# EAGLE design Fali_Potis (EAGLE 6.1)

## Sheet 1 of 2
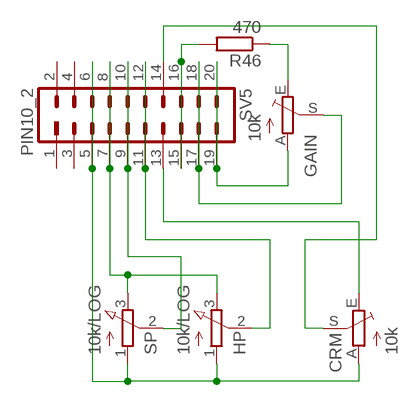
[diagram p0: schematic, sheet 1]

### Parts
CRM  10k  TRIM_EU-PT10S  [PT-10S]
GAIN  10k  TRIM_EU-PT10S  [PT-10S]
HP  10k/LOG  3RP/1610N  [3RP/1610N]
R46  470  R-EU_R0805  [R0805]
SP  10k/LOG  3RP/1610N  [3RP/1610N]
SV5  PIN10_2  [PIN10_2]

### Nets
N$10: CRM.E SV5.13
N$11: CRM.A HP.1(A) SP.1(A) SV5.5 SV5.6
N$30: HP.3(E) SP.3(E) SV5.7 SV5.8
N$33: SP.2(S) SV5.9 SV5.10
N$48: HP.2(S) SV5.11 SV5.12
N$58: CRM.S SV5.14
N$68: R46.2 SV5.15 SV5.16
N$69: GAIN.S SV5.17 SV5.18
N$70: GAIN.A SV5.19 SV5.20
N$73: GAIN.E R46.1
Unconnected: SV5.1 SV5.2 SV5.3 SV5.4

## Sheet 2 of 2

## Library data of the parts
CRM GAIN = pot:TRIM_EU-: POTENTIOMETER
HP SP = pot:3RP/1610N: 16mm Potentiometer one level Source: http://www.alphapotentiometers.net/html/16mm_pot_2.html
R46 = rcl:R-EU_: RESISTOR, European symbol
SV5 = Cf_Csatl:PIN10_2

## Net classes
0 default: width 0.305 mm, clearance 0.305 mm

## Board
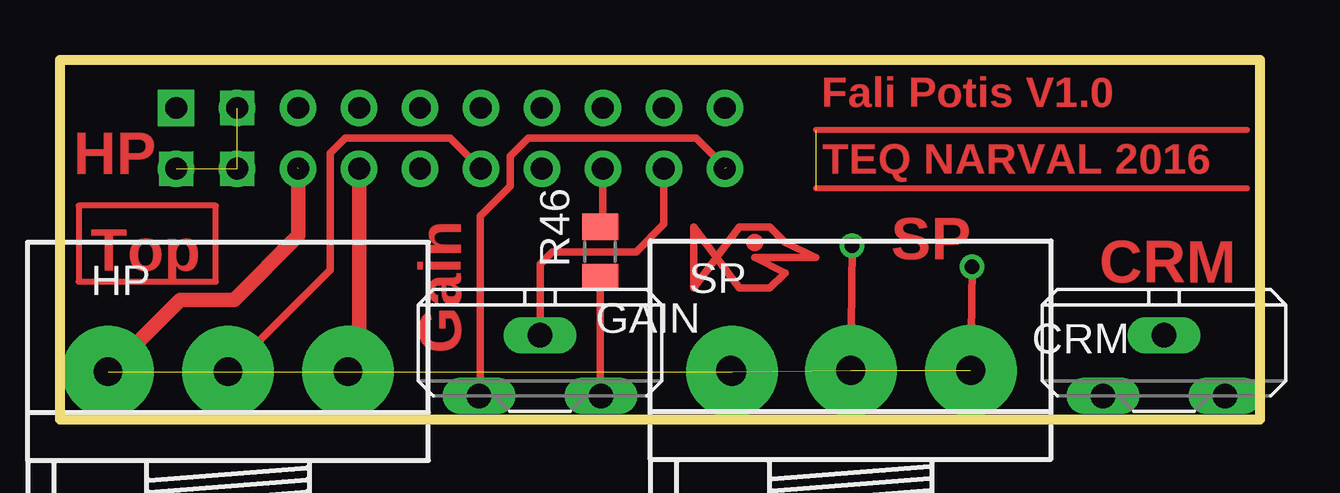
[diagram p1: board, top side]
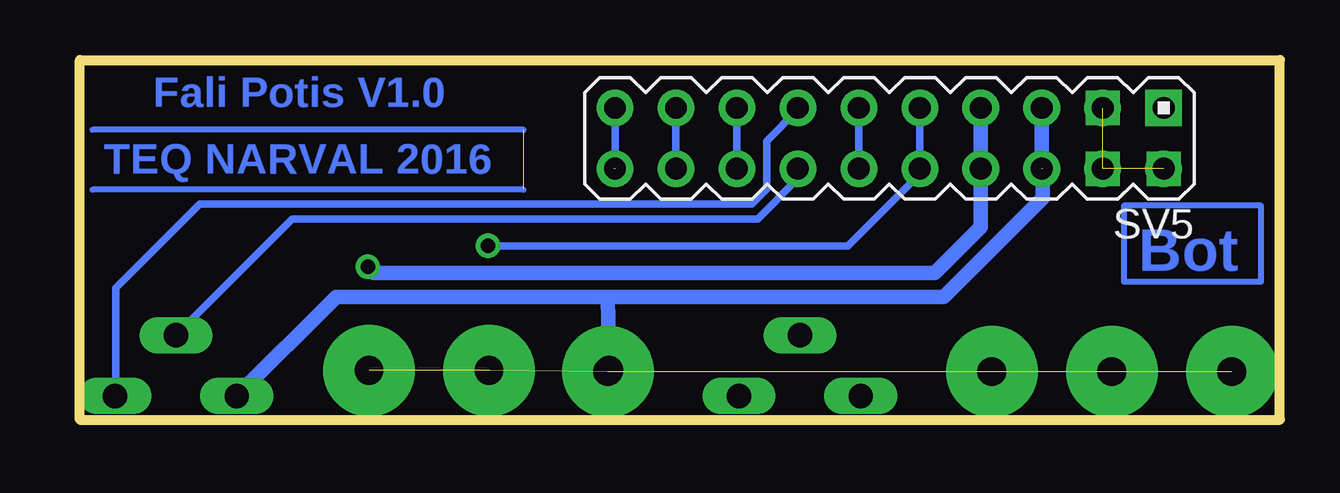
[diagram p2: board, bottom side, seen from below]

Size 50 x 15 mm. Coordinates in mm from the lower left corner, seen from the top.
Outline: 50,0 0,0 0,15 50,15 50,0
Copper layers (1*16): Top 0.035mm / dielectric 1.5mm / Bottom 0.035mm
Design rules: minimum track width 10mil, minimum drill 24mil, track to track 12mil, track to pad 12mil, pad to pad 12mil, via to via 12mil, smd to smd 10mil, copper to edge 10mil, drill to drill 10mil, minimum pad ring 10mil, minimum via ring 8mil, stop-mask expansion 4mil, vias tented up to drill 0mil, thermal gap 10mil

### Footprints (pad centres in the part's own frame; a part is rotated, then mirrored left to right if it is on the bottom)
PT-10S = drill 1.016 long: A -2.54,-1.27; E 2.54,-1.27; S 0,1.27
3RP/1610N = drill 1.2 pad 2.184: 1 -5,0; 2 0,0; 3 5,0
R0805 = smd 1.1 x 1.5: 1 -1.05,0; 2 1.05,0
PIN10_2 = drill 0.914 pad 1.524 square: 1 -10.16,0 | drill 0.914 pad 1.524: 2 -10.16,2.54; 3 -7.62,0; 4 -7.62,2.54; 5 -5.08,0; 6 -5.08,2.54; 7 -2.54,0; 8 -2.54,2.54; 9 0,0; 10 0,2.54; 11 2.54,0; 12 2.54,2.54; 13 5.08,0; 14 5.08,2.54; 15 7.62,0; 16 7.62,2.54; 17 10.16,0; 18 10.16,2.54; 19 12.7,0; 20 12.7,2.54

### Placement (x,y rotation side)
CRM  46,2.25 0 top
GAIN  20,2.25 0 top
HP  7,2 0 top
R46  22.5,7 90 top
SP  32.95,2.05 0 top
SV5  15,13 180 bottom

### Tracks (layer width: path | path; a pad name or v marks a point on that pad's centre or on a via)
HALACSKA1
  Top 0.305: 26.41,8.02 26.41,5.48 28.31,8.02 29.58,8.02 30.21,7.39 31.48,6.75 28.95,6.75 30.21,6.12 29.58,5.48 28.31,5.48 26.41,8.02
N$1  (2 unrouted)
  Top 0.254: 31.51,12.09 49.47,12.09
  Bottom 0.254: 31.51,9.59 49.47,9.59 | 31.51,12.09 49.47,12.09
N$2
  Top 0.254: 49.47,9.64 31.51,9.64
N$3  (via drill 1.2 pad 3.81)  (5 unrouted)
  other vias: 2,2 7,2 12,2 28,2 32.95,2.05 37.95,2.05
N$5  (via drill 0.91 pad 1.42)  (2 unrouted)
  other vias: 7.38,13 7.38,10.46 4.84,10.46
N$10
  Bottom 0.305: CRM.E 48.5,1.02 48.5,5.5 45,9 22,9 21.38,9.62 21.38,11.62 20.08,12.92 SV5.13
N$11  (1 unrouted)
  Top 0.61: HP.1 5,5 7.25,5 9.92,7.67 SV5.6
  Bottom 0.61: CRM.A 39.31,5.12 28,5.12 | 28,5.12 14,5.12 9.88,9.25 9.88,10.5 | SP.1 28,5.12 | SV5.5 SV5.6
N$30  (via drill 0.6)
  Top 0.305: SP.3 v38,6.38
  Top 0.61: HP.3 12.46,2.46 SV5.8
  Bottom 0.61: v38,6.38 37.75,6.12 14.38,6.12 12.46,8.04 SV5.8 SV5.7
N$33  (via drill 0.61)
  Top 0.305: SP.2 v33,7.25
  Bottom 0.305: v33,7.25 18,7.25 15,10.25 SV5.10 SV5.9
N$48
  Top 0.305: HP.2 11.25,6.25 11.25,11.12 11.88,11.75 16.25,11.75 SV5.12
  Bottom 0.305: SV5.11 SV5.12
N$58
  Bottom 0.305: CRM.S 41.15,8.38 21.75,8.38 20.08,10.04 SV5.14
N$68
  Top 0.305: R46.2 22.62,8.17 SV5.16
  Bottom 0.305: SV5.15 SV5.16
N$69
  Top 0.305: GAIN.S 20,6.5 20.5,7 24,7 25.16,8.16 SV5.18
  Bottom 0.305: SV5.17 SV5.18
N$70  (1 unrouted)
  Top 0.305: GAIN.A 17.5,1.02 17.5,8.5 18.75,9.75 18.75,11 19.5,11.75 26.5,11.75 27.75,10.5
  Bottom 0.305: SV5.19 SV5.20
N$73
  Top 0.305: GAIN.E 22.5,1.02 R46.1
N$96
  Bottom 0.254: 6.49,8.93 6.49,5.75 0.78,5.75 0.78,8.93 6.49,8.93
N$103
  Top 0.254: 0.78,8.93 0.78,5.75 6.49,5.75 6.49,8.93 0.78,8.93
(copper drawn outside any net)
  shapes: Top circle x1

### Text on the board
Top: Fali Potis V1.0 | HP | TEQ NARVAL 2016 | Top | SP | CRM | Gain
Bottom: Fali Potis V1.0 | TEQ NARVAL 2016 | Bot